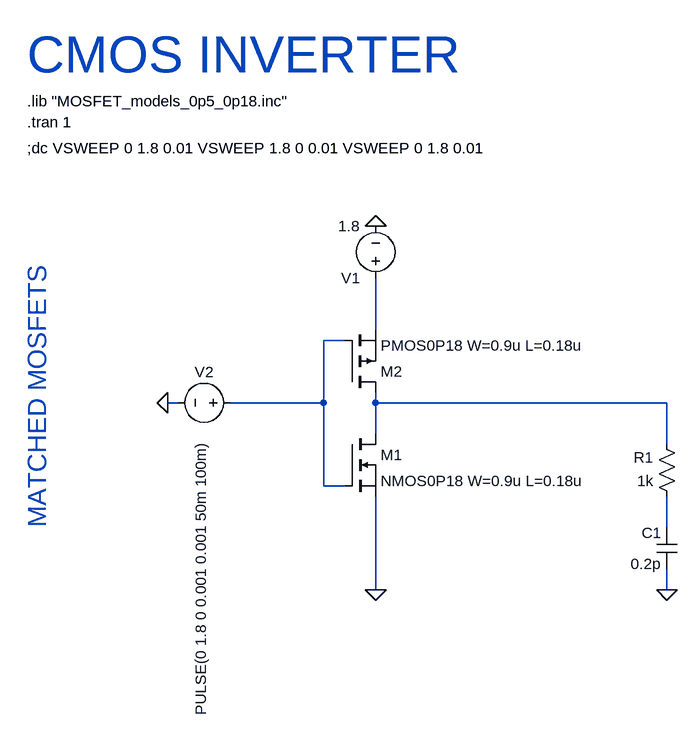
[diagram p0: schematic CMOS_INV_MINIMUM.asc]
CMOS_INV_MINIMUM.asc, the LTspice schematic file:
Version 4
SHEET 1 1700 1640
WIRE -880 -224 -880 -304
WIRE -928 -208 -960 -208
WIRE -1184 -112 -1200 -112
WIRE -960 -112 -960 -208
WIRE -960 -112 -1104 -112
WIRE -880 -112 -880 -128
WIRE -432 -112 -880 -112
WIRE -880 -64 -880 -112
WIRE -432 -48 -432 -112
WIRE -960 16 -960 -112
WIRE -928 16 -960 16
WIRE -432 80 -432 32
WIRE -880 176 -880 32
WIRE -432 176 -432 144
FLAG -880 176 0
FLAG -880 -384 0
FLAG -1200 -112 0
FLAG -432 176 0
SYMBOL nmos -928 -64 R0
SYMATTR InstName M1
SYMATTR Value NMOS0P18 W=0.9u L=0.18u
SYMBOL pmos -928 -128 M180
SYMATTR InstName M2
SYMATTR Value PMOS0P18 W=0.9u L=0.18u
SYMBOL voltage -880 -288 R180
WINDOW 123 0 0 Left 0
WINDOW 39 0 0 Left 0
SYMATTR InstName V1
SYMATTR Value 1.8
SYMBOL voltage -1088 -112 R90
WINDOW 0 -32 56 VBottom 2
WINDOW 3 269 45 Top 2
WINDOW 123 0 0 Left 0
WINDOW 39 0 0 Left 0
SYMATTR InstName V2
SYMATTR Value PULSE(0 1.8 0 0.001 0.001 50m 100m)
SYMBOL res -416 48 R180
WINDOW 0 36 76 Left 2
WINDOW 3 36 40 Left 2
SYMATTR InstName R1
SYMATTR Value 1k
SYMBOL cap -416 144 R180
WINDOW 0 24 56 Left 2
WINDOW 3 24 8 Left 2
SYMATTR InstName C1
SYMATTR Value 0.2p
TEXT -1416 -576 Left 2 !.lib "MOSFET_models_0p5_0p18.inc"
TEXT -1416 -544 Left 2 !.tran 1
TEXT -1416 -504 Left 2 !;dc VSWEEP 0 1.8 0.01 VSWEEP 1.8 0 0.01 VSWEEP 0 1.8 0.01
TEXT -1400 80 VLeft 4 ;MATCHED MOSFETS
TEXT -1416 -648 Left 6 ;CMOS INVERTER

The netlist it stands for:
* CMOS_INV_MINIMUM.asc
M1 N003 N002 0 0 NMOS0P18 W=0.9u L=0.18u
M2 N003 N002 N001 N001 PMOS0P18 W=0.9u L=0.18u
V1 N001 0 1.8
V2 N002 0 PULSE(0 1.8 0 0.001 0.001 50m 100m)
R1 N004 N003 1k
C1 0 N004 0.2p
.model NMOS NMOS
.model PMOS PMOS
.lib standard.mos
.lib "MOSFET_models_0p5_0p18.inc"
.tran 1
;dc VSWEEP 0 1.8 0.01 VSWEEP 1.8 0 0.01 VSWEEP 0 1.8 0.01
* MATCHED MOSFETS
* CMOS INVERTER
.backanno
.end